# EAGLE design NavCom_Board_3 (EAGLE 7.2.0)
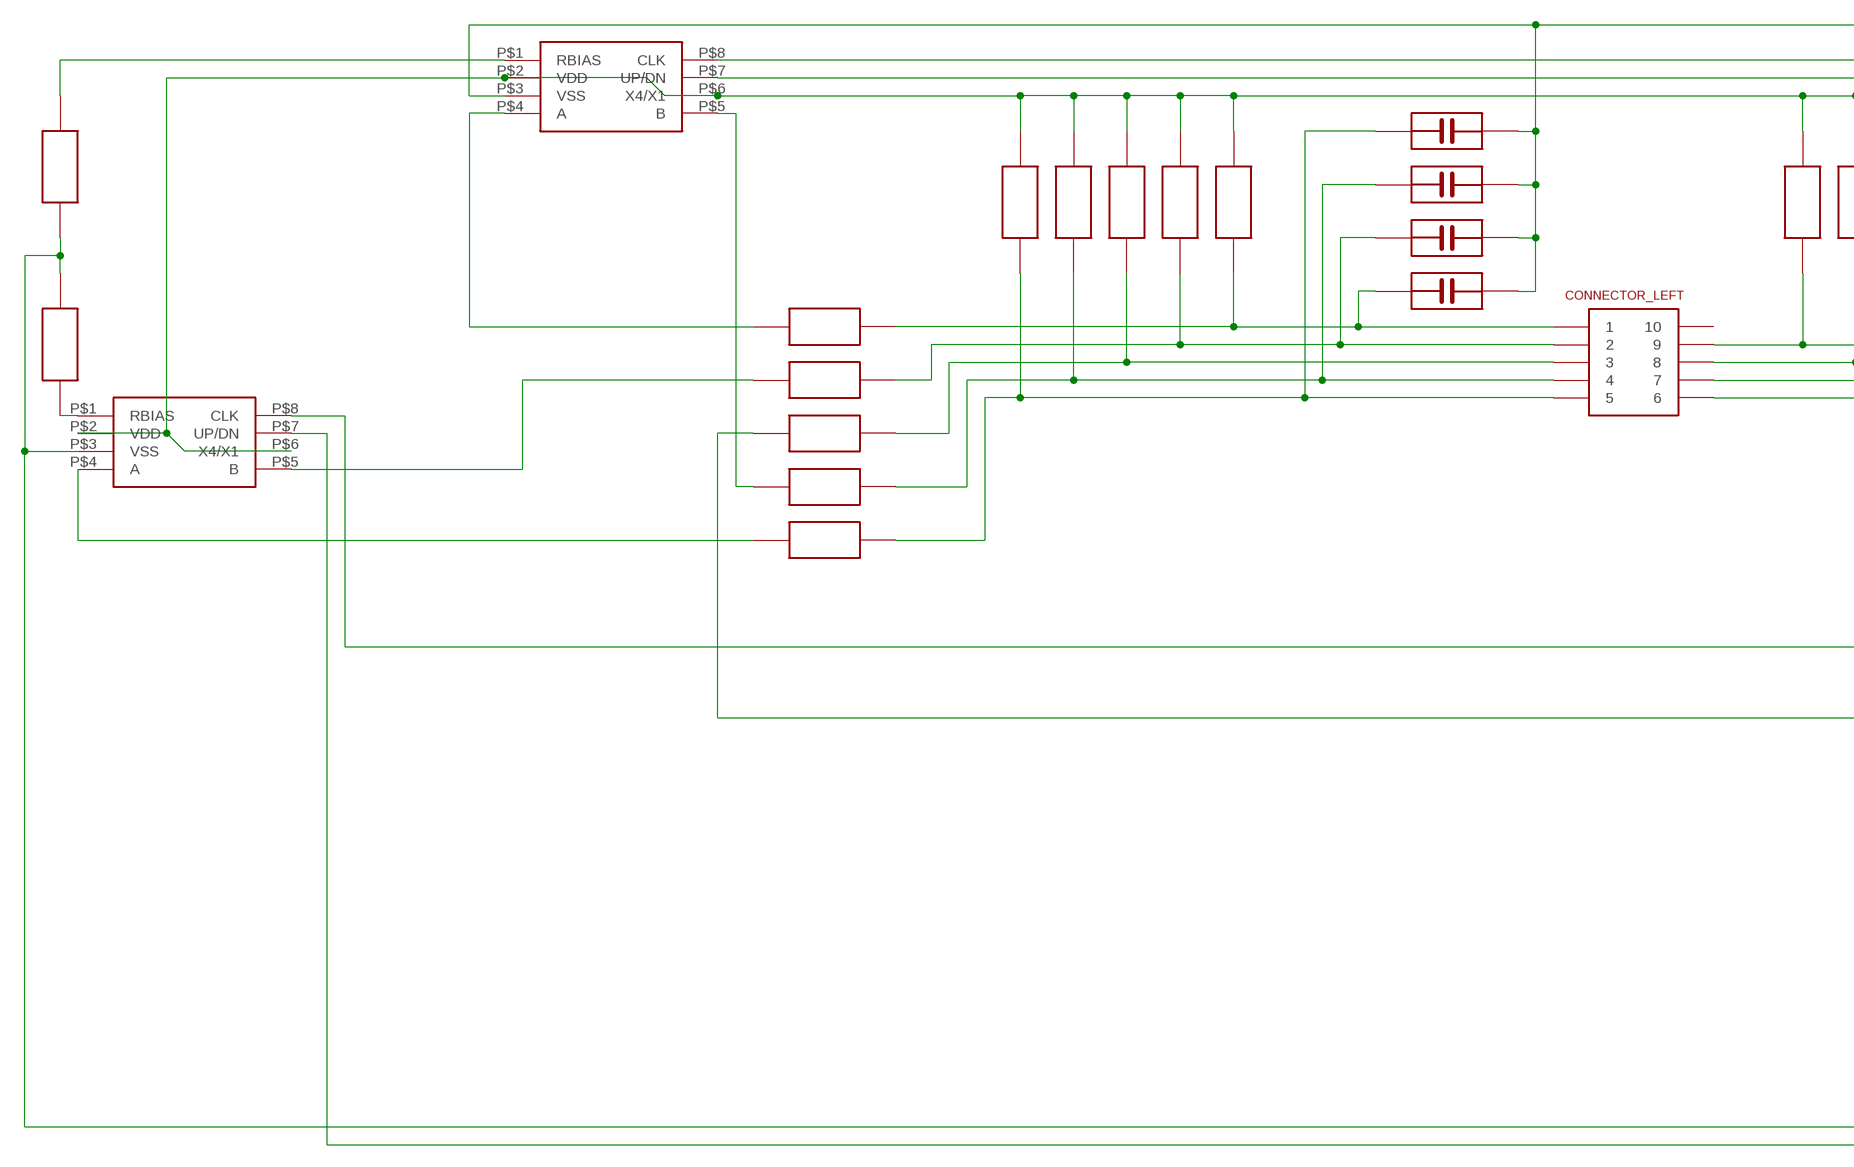
[diagram p0: schematic, sheet 1, part 1 of 2]
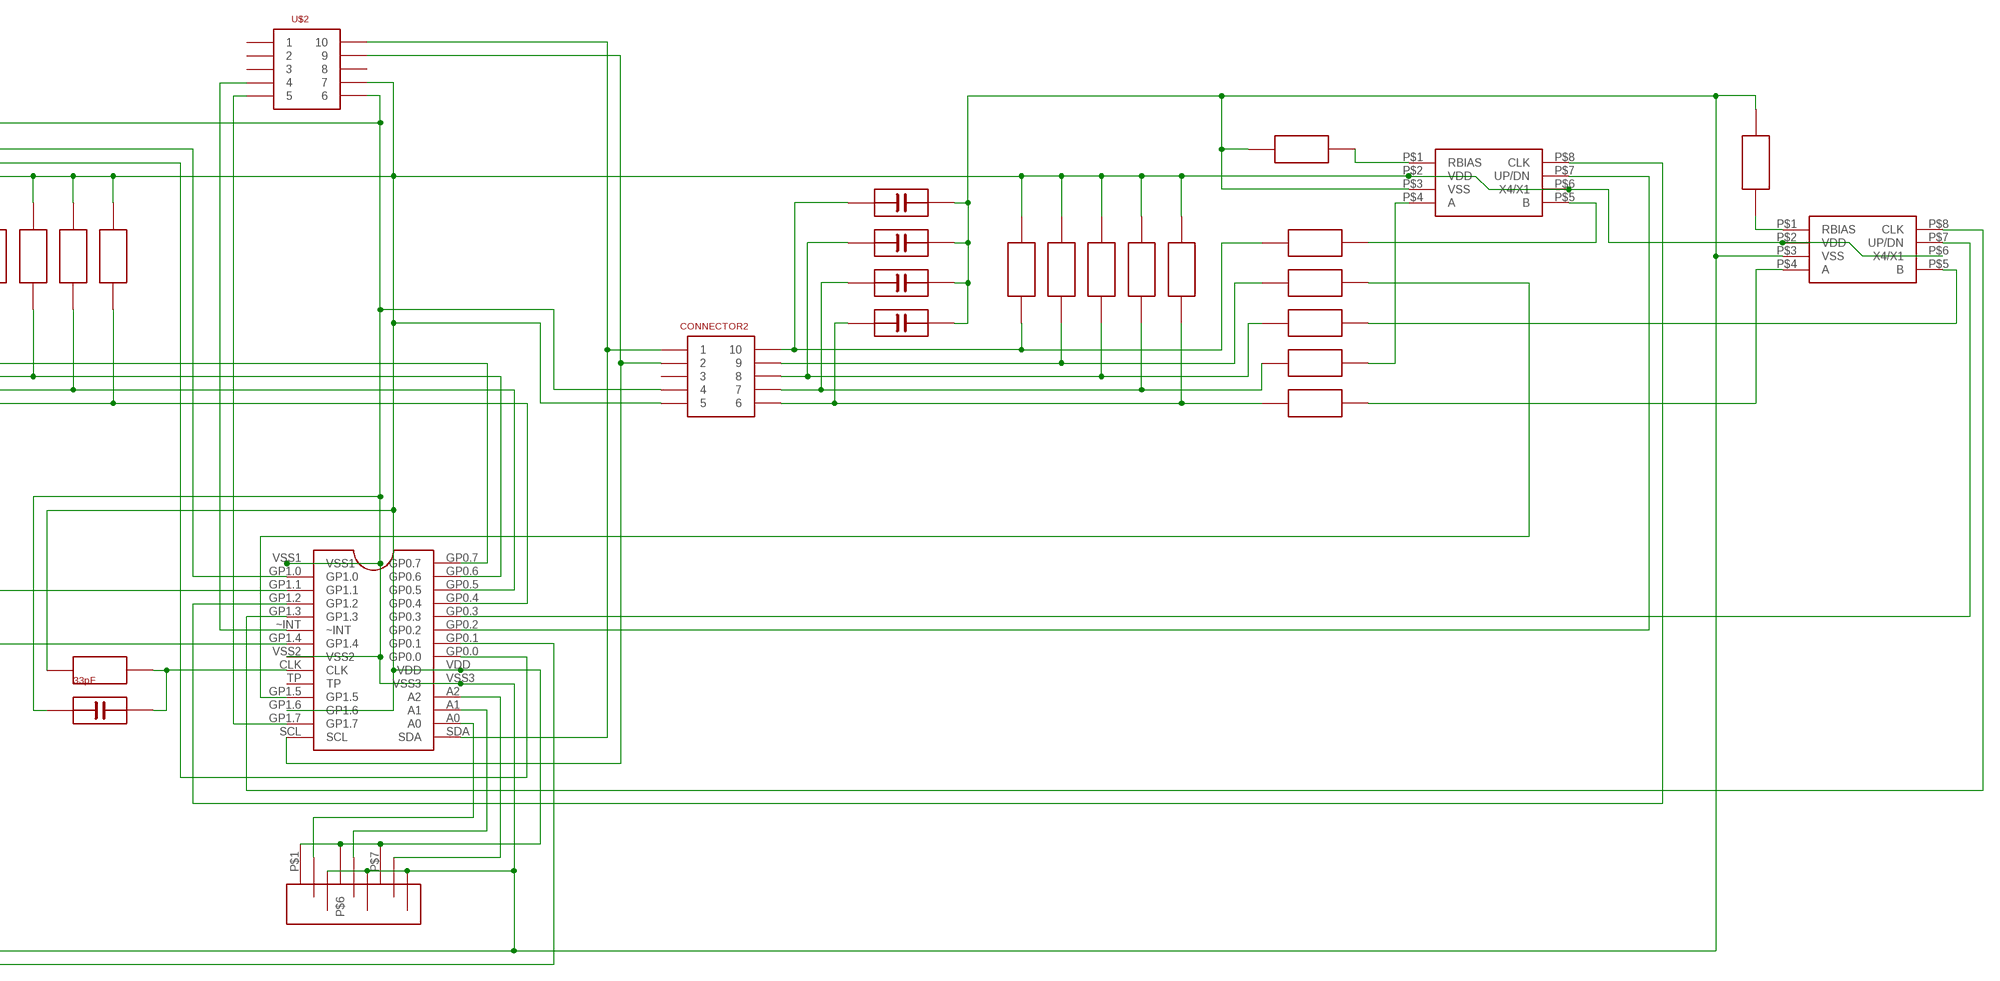
[diagram p1: schematic, sheet 1, part 2 of 2]

## Parts
33PF  33pF  KONDENZATOR  [KONDENZATOR]
CONNECTOR2  LISTA_2X5  [LISTA_2X5]
CONNECTOR_LEFT  LISTA_2X5  [LISTA_2X5]
U$1  MCP23016  [MCP23016]
U$2  LISTA_2X5  [LISTA_2X5]
U$3  LS7084  [LS7084]
U$4  LS7084  [LS7084]
U$5  LS7084  [LS7084]
U$6  LS7084  [LS7084]
U$7  REZISTOR  [REZISTOR]
U$8  470Ω  REZISTOR  [REZISTOR]
U$9  REZISTOR  [REZISTOR]
U$10  REZISTOR  [REZISTOR]
U$11  ADRESA_0..2  [ADRESA_0..2]
U$12  470Ω  REZISTOR  [REZISTOR]
U$13  REZISTOR  [REZISTOR]
U$14  REZISTOR  [REZISTOR]
U$15  REZISTOR  [REZISTOR]
U$16  470Ω  REZISTOR  [REZISTOR]
U$17  REZISTOR  [REZISTOR]
U$18  REZISTOR  [REZISTOR]
U$19  REZISTOR  [REZISTOR]
U$20  REZISTOR  [REZISTOR]
U$21  REZISTOR  [REZISTOR]
U$22  REZISTOR  [REZISTOR]
U$23  3.9k  REZISTOR  [REZISTOR]
U$24  103  KONDENZATOR  [KONDENZATOR]
U$25  KONDENZATOR  [KONDENZATOR]
U$26  KONDENZATOR  [KONDENZATOR]
U$27  470M  REZISTOR  [REZISTOR]
U$28  KONDENZATOR  [KONDENZATOR]
U$29  4.7k  REZISTOR  [REZISTOR]
U$30  REZISTOR  [REZISTOR]
U$31  REZISTOR  [REZISTOR]
U$32  REZISTOR  [REZISTOR]
U$33  REZISTOR  [REZISTOR]
U$34  470M  REZISTOR  [REZISTOR]
U$35  4.7k  REZISTOR  [REZISTOR]
U$36  REZISTOR  [REZISTOR]
U$37  KONDENZATOR  [KONDENZATOR]
U$38  REZISTOR  [REZISTOR]
U$39  REZISTOR  [REZISTOR]
U$40  470M  REZISTOR  [REZISTOR]
U$41  470M  REZISTOR  [REZISTOR]
U$42  KONDENZATOR  [KONDENZATOR]
U$43  KONDENZATOR  [KONDENZATOR]
U$44  103  KONDENZATOR  [KONDENZATOR]

## Nets
N$1: CONNECTOR2.10 U$7.P$1 U$29.P$2 U$37.P$1
N$2: CONNECTOR2.9 U$9.P$1 U$30.P$2
N$3: CONNECTOR2.8 U$10.P$1 U$31.P$2 U$42.P$1
N$4: CONNECTOR2.6 U$12.P$1 U$33.P$2 U$44.P$1
N$5: U$5.P$4(A) U$33.P$1
N$6: CONNECTOR2.7 U$17.P$1 U$32.P$2 U$43.P$1
N$7: 33PF.P$1 CONNECTOR2.4 U$1.VSS1 U$1.VSS2 U$1.VSS3 U$2.6 U$3.P$3(VSS) U$4.P$3(VSS) U$5.P$3(VSS) U$6.P$3(VSS) U$11.P$3 U$11.P$4 U$11.P$9 U$24.P$2 U$25.P$2 U$26.P$2 U$27.P$2 U$28.P$2 U$34.P$1 U$37.P$2 U$40.P$1 U$41.P$1 U$42.P$2 U$43.P$2 U$44.P$2
N$8: CONNECTOR2.5 U$1.GP1.6 U$1.VDD U$2.7 U$3.P$2(VDD) U$3.P$6(X4/X1) U$4.P$2(VDD) U$4.P$6(X4/X1) U$5.P$2(VDD) U$5.P$6(X4/X1) U$6.P$2(VDD) U$6.P$6(X4/X1) U$7.P$2 U$8.P$1 U$9.P$2 U$10.P$2 U$11.P$1 U$11.P$6 U$11.P$7 U$12.P$2 U$13.P$1 U$14.P$1 U$15.P$1 U$16.P$1 U$17.P$2 U$18.P$1 U$19.P$1 U$20.P$1 U$21.P$1 U$23.P$1
N$9: CONNECTOR_LEFT.1 U$16.P$2 U$24.P$1 U$35.P$2
N$10: CONNECTOR_LEFT.2 U$13.P$2 U$25.P$1 U$36.P$2
N$11: U$1.GP1.4 U$22.P$1
N$12: CONNECTOR_LEFT.4 U$15.P$2 U$26.P$1 U$38.P$2
N$13: CONNECTOR_LEFT.5 U$18.P$2 U$28.P$1 U$39.P$2
N$14: U$6.P$4(A) U$39.P$1
N$15: U$4.P$4(A) U$32.P$1
N$16: CONNECTOR_LEFT.9 U$1.GP0.7 U$8.P$2
N$17: U$5.P$5(B) U$31.P$1
N$18: U$1.GP1.5 U$30.P$1
N$19: U$4.P$5(B) U$29.P$1
N$20: U$3.P$4(A) U$35.P$1
N$21: CONNECTOR_LEFT.3 U$14.P$2 U$22.P$2
N$22: U$4.P$1(RBIAS) U$27.P$1
N$23: U$6.P$5(B) U$36.P$1
N$24: U$1.GP0.2 U$4.P$7(UP/DN)
N$26: U$1.GP1.2 U$4.P$8(CLK)
N$28: U$1.A2 U$11.P$8
N$29: U$3.P$1(RBIAS) U$40.P$2
N$30: U$5.P$1(RBIAS) U$34.P$2
N$31: CONNECTOR_LEFT.8 U$1.GP0.6 U$19.P$2
N$32: U$1.GP0.3 U$5.P$7(UP/DN)
N$33: U$1.GP1.3 U$5.P$8(CLK)
N$34: U$1.GP1.0 U$3.P$8(CLK)
N$35: U$1.GP0.0 U$3.P$7(UP/DN)
N$36: U$1.GP1.1 U$6.P$8(CLK)
N$37: U$6.P$1(RBIAS) U$41.P$2
N$38: U$1.A1 U$11.P$5
N$39: U$1.GP0.1 U$6.P$7(UP/DN)
N$40: U$1.A0 U$11.P$2
N$41: 33PF.P$2 U$1.CLK U$23.P$2
N$42: CONNECTOR2.1 U$1.SDA U$2.10
N$43: CONNECTOR2.2 U$1.SCL U$2.9
N$45: U$1.~INT U$2.4
N$46: CONNECTOR_LEFT.7 U$1.GP0.5 U$20.P$2
N$47: U$1.GP1.7 U$2.5
N$48: CONNECTOR_LEFT.6 U$1.GP0.4 U$21.P$2
N$49: U$3.P$5(B) U$38.P$1
Unconnected: CONNECTOR2.3 CONNECTOR_LEFT.10 U$1.TP U$2.1 U$2.2 U$2.3 U$2.8

## Library data of the parts
33PF U$24-U$26 U$28 U$37 U$42-U$44 = RadioStack_v2:KONDENZATOR
CONNECTOR2 CONNECTOR_LEFT U$2 = RadioStack_v2:LISTA_2X5
U$1 = RadioStack_v2:MCP23016
U$3-U$6 = RadioStack_v2:LS7084
U$7-U$10 U$12-U$23 U$27 U$29-U$36 U$38-U$41 = RadioStack_v2:REZISTOR
U$11 = RadioStack_v2:ADRESA_0..2

## Board
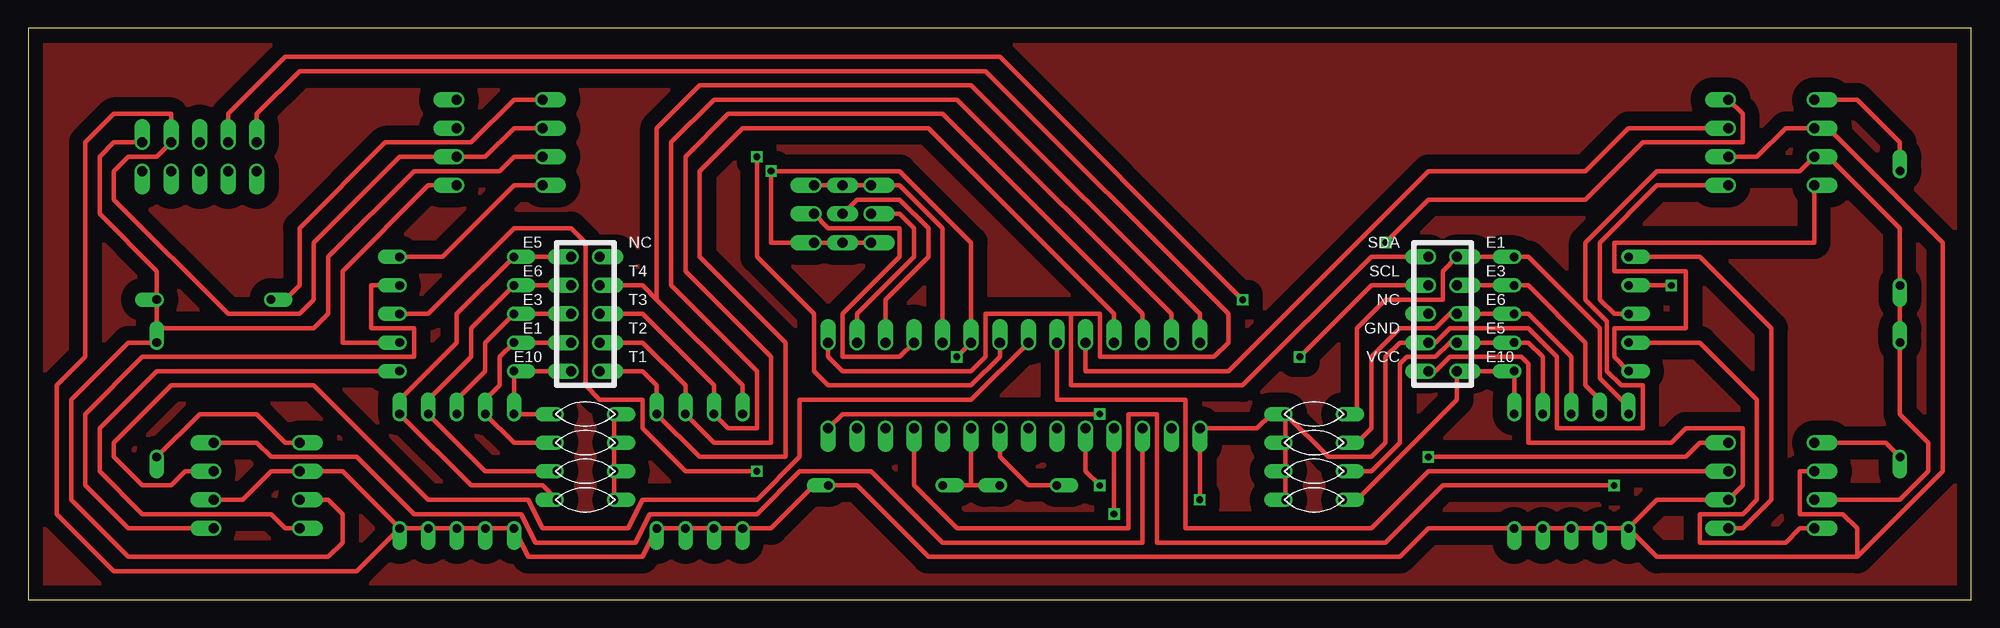
[diagram p2: board, top side]
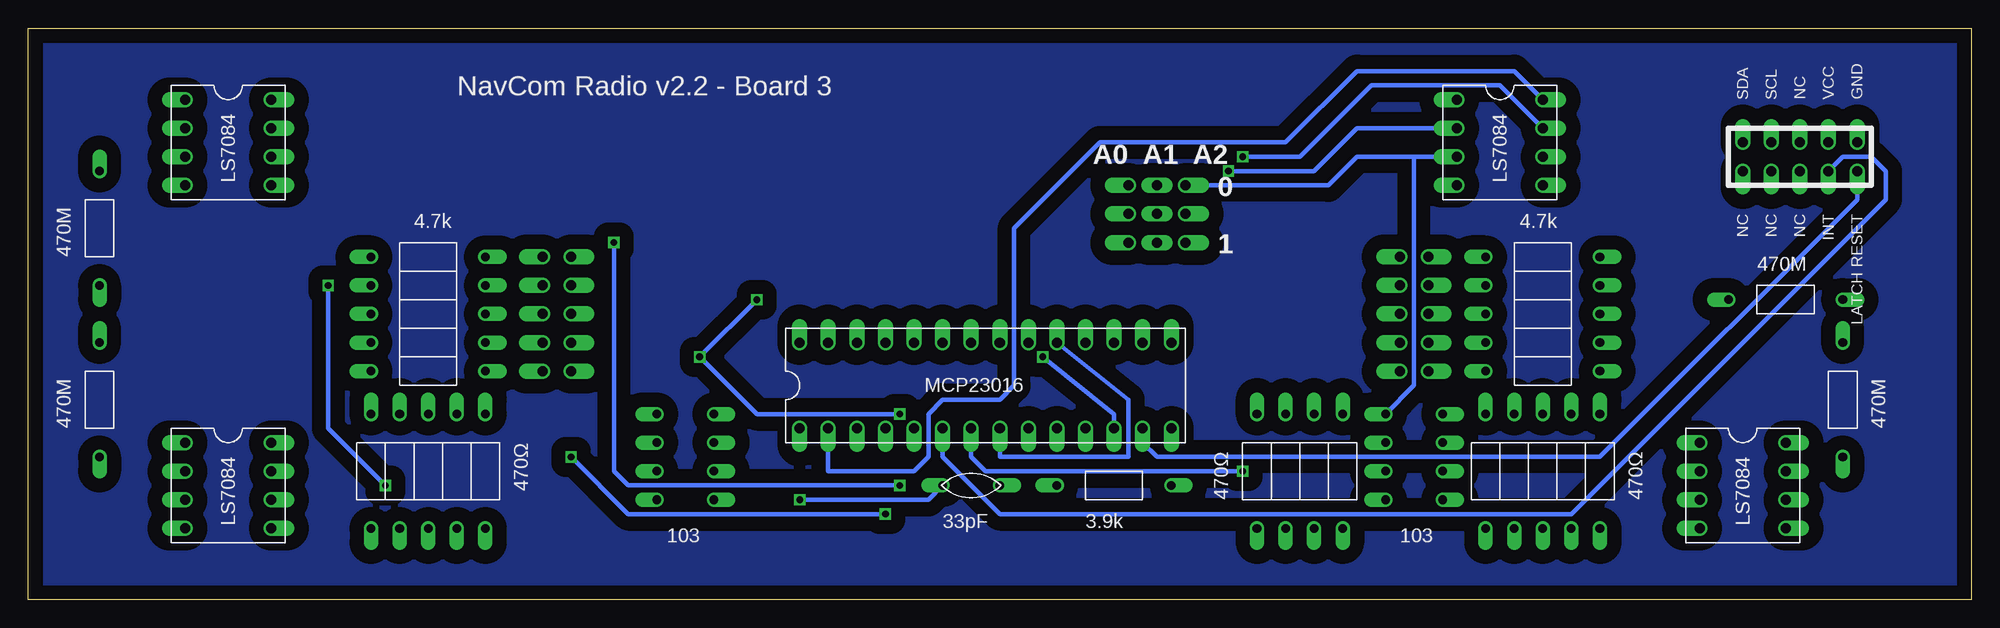
[diagram p3: board, bottom side, seen from below]

Size 172.72 x 50.8 mm. Coordinates in mm from the lower left corner, seen from the top.
Outline: 0,50.8 0,0 172.72,0 172.72,50.8 0,50.8
Copper layers (1*16): Top 0.035mm / dielectric 1.5mm / Bottom 0.035mm
Design rules "RadioStack_v2": minimum track width 0.2mm, minimum drill 0.4mm, track to track 0.2mm, track to pad 0.2mm, pad to pad 0.2mm, via to via 0.2mm, smd to smd 0.2mm, copper to edge 0.5mm, drill to drill 8mil, minimum pad ring 10mil, minimum via ring 8mil, stop-mask expansion 4mil, vias tented up to drill 0mil, thermal gap 10mil

### Footprints (pad centres in the part's own frame; a part is rotated, then mirrored left to right if it is on the bottom)
KONDENZATOR = drill 0.762 pad 1.27 offset: P$1 -2.54,0; P$2 2.54,0
LISTA_2X5 = drill 0.889 pad 1.27 offset: 1 0,0; 2 0,-2.54; 3 0,-5.08; 4 0,-7.62; 5 0,-10.16; 6 2.54,-10.16; 7 2.54,-7.62; 8 2.54,-5.08; 9 2.54,-2.54; 10 2.54,0
MCP23016 = drill 0.889 pad 1.27 offset: A0 7.62,-30.48; A1 7.62,-27.94; A2 7.62,-25.4; CLK 0,-20.32; GP0.0 7.62,-17.78; GP0.1 7.62,-15.24; GP0.2 7.62,-12.7; GP0.3 7.62,-10.16; GP0.4 7.62,-7.62; GP0.5 7.62,-5.08; GP0.6 7.62,-2.54; GP0.7 7.62,0; GP1.0 0,-2.54; GP1.1 0,-5.08; GP1.2 0,-7.62; GP1.3 0,-10.16; GP1.4 0,-15.24; GP1.5 0,-25.4; GP1.6 0,-27.94; GP1.7 0,-30.48; SCL 0,-33.02; SDA 7.62,-33.02; TP 0,-22.86; VDD 7.62,-20.32; VSS1 0,0; VSS2 0,-17.78; VSS3 7.62,-22.86; ~INT 0,-12.7
LS7084 = drill 0.889 pad 1.27 offset: P$1 0,0; P$2 0,-2.54; P$3 0,-5.08; P$4 0,-7.62; P$5 7.62,-7.62; P$6 7.62,-5.08; P$7 7.62,-2.54; P$8 7.62,0
REZISTOR = drill 0.762 pad 1.27 offset: P$1 -5.08,0; P$2 5.08,0
ADRESA_0..2 = drill 0.889 pad 1.27 offset: P$1 0,0; P$2 0,-2.54; P$3 0,-5.08; P$7 5.08,0; P$8 5.08,-2.54; P$9 5.08,-5.08 | drill 0.889 pad 1.27 long: P$4 2.54,-5.08; P$5 2.54,-2.54; P$6 2.54,0

### Placement (x,y rotation side)
33PF  88.9,10.16 0 bottom
CONNECTOR2  124.46,30.48 0 top
CONNECTOR_LEFT  48.26,30.48 0 top
U$1  104.14,15.24 90 bottom
U$2  20.32,38.1 90 bottom
U$3  45.72,44.45 0 bottom
U$4  158.75,13.97 0 bottom
U$5  158.75,44.45 0 bottom
U$6  24.13,13.97 0 bottom
U$7  142.24,11.43 270 bottom
U$8  63.5,11.43 90 bottom
U$9  139.7,11.43 270 bottom
U$10  137.16,11.43 270 bottom
U$11  74.93,31.75 180 top
U$12  132.08,11.43 270 bottom
U$13  35.56,11.43 90 bottom
U$14  38.1,11.43 90 bottom
U$15  40.64,11.43 90 bottom
U$16  33.02,11.43 90 bottom
U$17  134.62,11.43 270 bottom
U$18  43.18,11.43 90 bottom
U$19  60.96,11.43 90 bottom
U$20  58.42,11.43 90 bottom
U$21  55.88,11.43 90 bottom
U$22  38.1,25.4 180 bottom
U$23  76.2,10.16 180 bottom
U$24  49.53,8.89 0 top
U$25  49.53,11.43 0 top
U$26  49.53,13.97 0 top
U$27  166.37,17.78 90 bottom
U$28  49.53,16.51 0 top
U$29  137.16,30.48 0 bottom
U$30  137.16,27.94 0 bottom
U$31  137.16,25.4 0 bottom
U$32  137.16,22.86 0 bottom
U$33  137.16,20.32 0 bottom
U$34  166.37,33.02 90 bottom
U$35  38.1,30.48 180 bottom
U$36  38.1,27.94 180 bottom
U$37  114.3,16.51 180 top
U$38  38.1,22.86 180 bottom
U$39  38.1,20.32 180 bottom
U$40  16.51,26.67 180 bottom
U$41  11.43,17.78 270 bottom
U$42  114.3,13.97 180 top
U$43  114.3,11.43 180 top
U$44  114.3,8.89 180 top

### Tracks (layer width: path | path; a pad name or v marks a point on that pad's centre or on a via)
N$1
  Top 0.406: U$7.P$1 142.24,17.14 139.7,19.68 139.7,24.13 133.35,30.48 U$29.P$2 CONNECTOR2.10 125.73,29.21 125.73,26.67 120.65,26.67 118.11,24.13 118.11,16.51 U$37.P$1
N$2
  Top 0.406: U$9.P$1 139.7,17.78 138.43,19.05 138.43,22.86 133.35,27.94 U$30.P$2 CONNECTOR2.9
N$3
  Top 0.406: U$10.P$1 137.16,21.59 133.35,25.4 U$31.P$2 CONNECTOR2.8 126.36,25.4 125.09,24.13 121.92,24.13 119.38,21.59 119.38,15.24 118.11,13.97 U$42.P$1
N$4
  Top 0.406: U$12.P$1 U$33.P$2 CONNECTOR2.6 127,17.78 118.11,8.89 U$44.P$1
N$5
  Top 0.406: U$33.P$1 140.97,21.59 140.97,24.13 147.32,24.13 147.32,29.21 140.97,29.21 140.97,31.75 158.75,31.75 U$5.P$4
N$6
  Top 0.406: U$17.P$1 134.62,21.59 133.35,22.86 U$32.P$2 CONNECTOR2.7 126.36,22.86 125.09,21.59 122.56,21.59 121.92,20.95 121.92,13.97 119.38,11.43 U$43.P$1
N$7  (via drill 0.6)
  Top 0.406: U$24.P$2 U$25.P$2 U$26.P$2 U$28.P$2 | U$2.6 7.62,40.64 6.35,39.37 6.35,34.29 11.43,29.21 U$40.P$1 11.43,24.13 | 11.43,24.13 U$41.P$1 8.89,22.86 3.81,17.78 3.81,8.89 8.89,3.81 26.67,3.81 27.94,5.08 27.94,7.62 26.67,8.89 U$6.P$3 | U$3.P$3 43.18,39.37 41.91,38.1 34.29,38.1 26.67,30.48 26.67,25.4 25.4,24.13 11.43,24.13 | U$37.P$2 U$42.P$2 U$43.P$2 U$44.P$2 | U$37.P$2 110.49,16.51 109.22,15.24 U$1.VSS1 v104.14,8.89 | U$11.P$9 U$11.P$4 U$11.P$3 77.47,36.83 81.28,33.02 U$1.VSS3 | U$4.P$3 166.37,8.89 168.91,11.43 168.91,13.97 166.37,16.51 U$27.P$2 U$34.P$1 166.37,33.02 160.02,39.37 U$5.P$3 157.48,38.1 144.78,38.1 138.43,31.75 138.43,26.67 140.34,24.77 140.34,20.32 141.6,19.05 143.51,19.05 143.51,15.24 135.89,15.24 135.89,21.59 133.35,24.13 126.36,24.13 125.09,22.86 CONNECTOR2.4 121.92,22.86 120.65,21.59 120.65,13.97 119.38,12.7 115.57,12.7 U$37.P$2 | 33PF.P$1 88.9,10.16 86.36,12.7 U$1.VSS2
  Bottom 0.406: U$3.P$3 49.53,39.37 | 49.53,39.37 54.61,39.37 57.15,36.83 U$11.P$9 | U$28.P$2 49.53,19.05 49.53,39.37 | v104.14,8.89 92.71,8.89 33PF.P$1 | U$1.VSS2 86.36,12.7 74.93,12.7 74.93,17.78 U$1.VSS3 81.28,24.13
N$8  (via drill 0.6)
  Top 0.406: U$11.P$1 U$11.P$6 U$11.P$7 66.04,31.75 v66.04,38.1 77.47,38.1 83.82,31.75 U$1.VDD v82.55,21.59 | U$6.P$6 19.05,8.89 21.59,11.43 U$6.P$2 27.94,11.43 U$16.P$1 | U$3.P$2 43.18,41.91 40.64,39.37 U$3.P$6 33.02,39.37 25.4,31.75 25.4,26.67 24.13,25.4 17.78,25.4 7.62,35.56 7.62,38.1 8.89,39.37 11.43,39.37 U$2.7 12.7,43.18 7.62,43.18 5.08,40.64 5.08,21.59 2.54,19.05 2.54,7.62 7.62,2.54 29.21,2.54 U$16.P$1 | U$16.P$1 U$13.P$1 U$14.P$1 U$15.P$1 U$18.P$1 44.45,3.81 54.61,3.81 U$21.P$1 U$20.P$1 U$19.P$1 U$8.P$1 66.04,6.35 69.85,10.16 U$23.P$1 73.66,10.16 80.01,3.81 121.92,3.81 124.46,6.35 U$12.P$2 U$17.P$2 U$10.P$2 U$9.P$2 U$7.P$2 | U$5.P$6 153.67,39.37 156.21,41.91 U$5.P$2 160.02,41.91 170.18,31.75 170.18,11.43 162.56,3.81 | U$4.P$2 157.48,11.43 157.48,7.62 161.29,7.62 162.56,6.35 162.56,3.81 | 162.56,3.81 144.78,3.81 U$7.P$2 | U$7.P$2 144.78,8.89 U$4.P$6 152.4,10.16 152.4,15.24 147.32,15.24 146.05,13.97 133.35,13.97 133.35,20.95 132.72,21.59 126.36,21.59 125.09,20.32 CONNECTOR2.5
  Bottom 0.406: v66.04,38.1 58.42,38.1 54.61,41.91 U$3.P$2 | v82.55,21.59 76.2,16.51 U$1.GP1.6
N$9
  Top 0.406: CONNECTOR_LEFT.1 U$35.P$2 38.1,25.4 38.1,22.86 33.02,17.78 U$16.P$2 39.37,10.16 45.72,10.16 U$24.P$1
N$10
  Top 0.406: CONNECTOR_LEFT.2 U$36.P$2 39.37,24.13 39.37,21.59 35.56,17.78 U$13.P$2 40.64,11.43 U$25.P$1
N$11  (via drill 0.6)
  Top 0.406: v64.77,11.43 58.42,11.43 54.61,15.24 54.61,17.78 50.8,17.78 49.53,19.05 49.53,31.75 48.26,33.02 43.18,33.02 35.56,25.4 U$22.P$1
  Bottom 0.406: v64.77,11.43 87.63,11.43 88.9,12.7 U$1.GP1.4
N$12
  Top 0.406: CONNECTOR_LEFT.4 U$38.P$2 41.91,21.59 41.91,19.05 40.64,17.78 U$15.P$2 43.18,13.97 U$26.P$1
N$13
  Top 0.406: CONNECTOR_LEFT.5 U$39.P$2 U$18.P$2 U$28.P$1
N$14
  Top 0.406: U$6.P$4 22.86,6.35 21.59,7.62 10.16,7.62 6.35,11.43 6.35,15.24 11.43,20.32 U$39.P$1
N$15
  Top 0.406: U$32.P$1 148.59,22.86 153.67,17.78 153.67,8.89 152.4,7.62 148.59,7.62 148.59,5.08 156.21,5.08 157.48,6.35 U$4.P$4
N$16
  Top 0.406: 55.88,26.67 55.88,41.91 59.69,45.72 83.82,45.72 104.14,25.4 U$1.GP0.7 | 55.88,26.67 63.5,19.05 U$8.P$2 | CONNECTOR_LEFT.9 54.61,27.94 55.88,26.67
N$17
  Top 0.406: U$31.P$1 140.97,25.4 139.7,26.67 139.7,31.75 144.78,36.83 U$5.P$5
N$18  (via drill 0.6)
  Top 0.406: v140.97,10.16 125.73,10.16 120.65,5.08 100.33,5.08 100.33,16.51 97.79,16.51 97.79,6.35 82.55,6.35 78.74,10.16 U$1.GP1.5 | U$30.P$1 v146.05,27.94
  Bottom 0.406: v146.05,27.94 146.05,15.24 v140.97,10.16
N$19
  Top 0.406: U$4.P$5 152.4,6.35 154.94,8.89 154.94,24.13 148.59,30.48 U$29.P$1
N$20
  Top 0.406: U$3.P$4 43.18,36.83 36.83,30.48 U$35.P$1
N$21
  Top 0.406: U$14.P$2 38.1,17.78 40.64,20.32 40.64,22.86 U$22.P$2 CONNECTOR_LEFT.3
N$22
  Top 0.406: U$4.P$1 165.1,13.97 U$27.P$1
N$23
  Top 0.406: U$6.P$5 8.89,6.35 5.08,10.16 5.08,16.51 10.16,21.59 34.29,21.59 34.29,24.13 30.48,24.13 30.48,27.94 U$36.P$1
N$24
  Top 0.406: U$4.P$7 124.46,11.43 119.38,6.35 102.87,6.35 102.87,17.78 91.44,17.78 U$1.GP0.2
N$25
  pour Top (isolate 1.27): 1.27,49.53 171.45,49.53 171.45,1.27 1.27,1.27
N$26  (via drill 0.6)
  Top 0.406: U$4.P$8 148.59,13.97 147.32,12.7 v124.46,12.7 | v96.52,7.62 U$1.GP1.2
  Bottom 0.406: v124.46,12.7 119.38,7.62 v96.52,7.62
N$27
  pour Bottom (isolate 1.27): 1.27,49.53 171.45,49.53 171.45,1.27 1.27,1.27
N$28
  Top 0.406: U$11.P$8 71.12,33.02 77.47,33.02 77.47,30.48 72.39,25.4 72.39,21.59 77.47,21.59 U$1.A2
N$29
  Top 0.406: U$3.P$1 43.18,44.45 39.37,40.64 31.75,40.64 24.13,33.02 24.13,27.94 22.86,26.67 U$40.P$2
N$30
  Top 0.406: U$5.P$1 162.56,44.45 166.37,40.64 U$34.P$2
N$31
  Top 0.406: U$1.GP0.6 101.6,25.4 82.55,44.45 60.96,44.45 57.15,40.64 57.15,27.94 64.77,20.32 64.77,15.24 62.23,15.24 U$19.P$2 60.96,19.05 54.61,25.4 CONNECTOR_LEFT.8
N$32
  Top 0.406: U$5.P$7 142.24,41.91 138.43,38.1 124.46,38.1 106.68,20.32 93.98,20.32 U$1.GP0.3
N$33  (via drill 0.6)
  Top 0.406: U$5.P$8 152.4,43.18 152.4,40.64 143.51,40.64 138.43,35.56 124.46,35.56 v120.65,31.75 | v95.25,10.16 93.98,11.43 U$1.GP1.3
  Bottom 0.406: v95.25,10.16 119.38,10.16 120.65,11.43 v120.65,31.75
N$34
  Bottom 0.406: U$1.GP1.0 101.6,11.43 93.98,11.43 92.71,12.7 92.71,16.51 91.44,17.78 86.36,17.78 85.09,19.05 85.09,33.02 77.47,40.64 60.96,40.64 54.61,46.99 40.64,46.99 U$3.P$8
N$35  (via drill 0.6)
  Top 0.406: U$1.GP0.0 86.36,21.59 83.82,19.05 71.12,19.05 69.85,20.32 69.85,25.4 64.77,30.48 v64.77,39.37
  Bottom 0.406: v64.77,39.37 59.69,39.37 53.34,45.72 41.91,45.72 U$3.P$7
N$36
  Top 0.406: U$6.P$8 20.32,13.97 21.59,12.7 29.21,12.7 34.29,7.62 43.81,7.62 45.09,5.08 53.98,5.08 55.24,7.62 64.77,7.62 68.58,11.43 74.93,11.43 81.28,5.08 99.06,5.08 U$1.GP1.1
N$37
  Top 0.406: U$6.P$1 22.86,13.97 20.32,16.51 15.24,16.51 U$41.P$2
N$38
  Top 0.406: U$11.P$5 73.66,35.56 77.47,35.56 80.01,33.02 80.01,30.48 76.2,26.67 U$1.A1
N$39
  Top 0.406: U$1.GP0.1 83.82,17.78 68.58,17.78 68.58,12.7 64.77,8.89 54.61,8.89 53.34,6.35 45.72,6.35 44.45,8.89 35.56,8.89 25.4,19.05 12.7,19.05 7.62,13.97 7.62,12.7 10.16,10.16 12.7,10.16 13.97,11.43 U$6.P$7
N$40
  Top 0.406: U$11.P$2 77.47,34.29 78.74,33.02 78.74,30.48 73.66,25.4 U$1.A0
N$41
  Top 0.406: U$1.CLK 83.82,10.16 | 83.82,10.16 U$23.P$2 | 83.82,10.16 33PF.P$2
N$42
  Top 0.406: 92.71,25.4 92.71,19.05 107.95,19.05 119.38,30.48 CONNECTOR2.1 | 92.71,25.4 85.09,25.4 85.09,21.59 83.82,20.32 72.39,20.32 71.12,21.59 U$1.SDA | 92.71,25.4 95.25,25.4 95.25,21.59 105.41,21.59 106.68,22.86 106.68,25.4 85.09,46.99 24.13,46.99 20.32,43.18 U$2.10
N$43  (via drill 0.6)
  Top 0.406: U$1.SCL 72.39,16.51 v95.25,16.51 | U$2.9 17.78,43.18 22.86,48.26 86.36,48.26 v107.95,26.67 | v113.03,21.59 119.38,27.94 CONNECTOR2.2
  Bottom 0.406: v95.25,16.51 107.95,16.51 v113.03,21.59 v107.95,26.67
N$45
  Bottom 0.406: U$2.4 11.43,39.37 8.89,39.37 7.62,38.1 7.62,35.56 35.56,7.62 86.36,7.62 91.44,12.7 U$1.~INT
N$46
  Top 0.406: U$1.GP0.5 99.06,25.4 81.28,43.18 62.23,43.18 58.42,39.37 58.42,29.21 66.04,21.59 66.04,13.97 60.96,13.97 U$20.P$2 58.42,19.05 54.61,22.86 CONNECTOR_LEFT.7
N$47
  Bottom 0.406: U$1.GP1.7 73.66,13.97 72.39,12.7 33.02,12.7 10.16,35.56 U$2.5
N$48
  Top 0.406: U$1.GP0.4 96.52,25.4 80.01,41.91 63.5,41.91 59.69,38.1 59.69,30.48 67.31,22.86 67.31,12.7 59.69,12.7 U$21.P$2 55.88,19.05 54.61,20.32 CONNECTOR_LEFT.6
N$49
  Top 0.406: U$3.P$5 35.56,36.83 27.94,29.21 27.94,22.86 U$38.P$1

### Text on the board
tPlace: E5 | NC | SDA | E1 | E6 | T4 | SCL | E3 | E3 | T3 | NC | E6 | E1 | T2 | GND | E5 | E10 | T1 | VCC | E10
bPlace: NavCom Radio v2.2 - Board 3 | GND | VCC | NC | SCL | SDA | A2 | A1 | A0 | 0 | LATCH RESET | INT | NC | NC | NC | 1